# Altium project Smart_home.PrjPcb
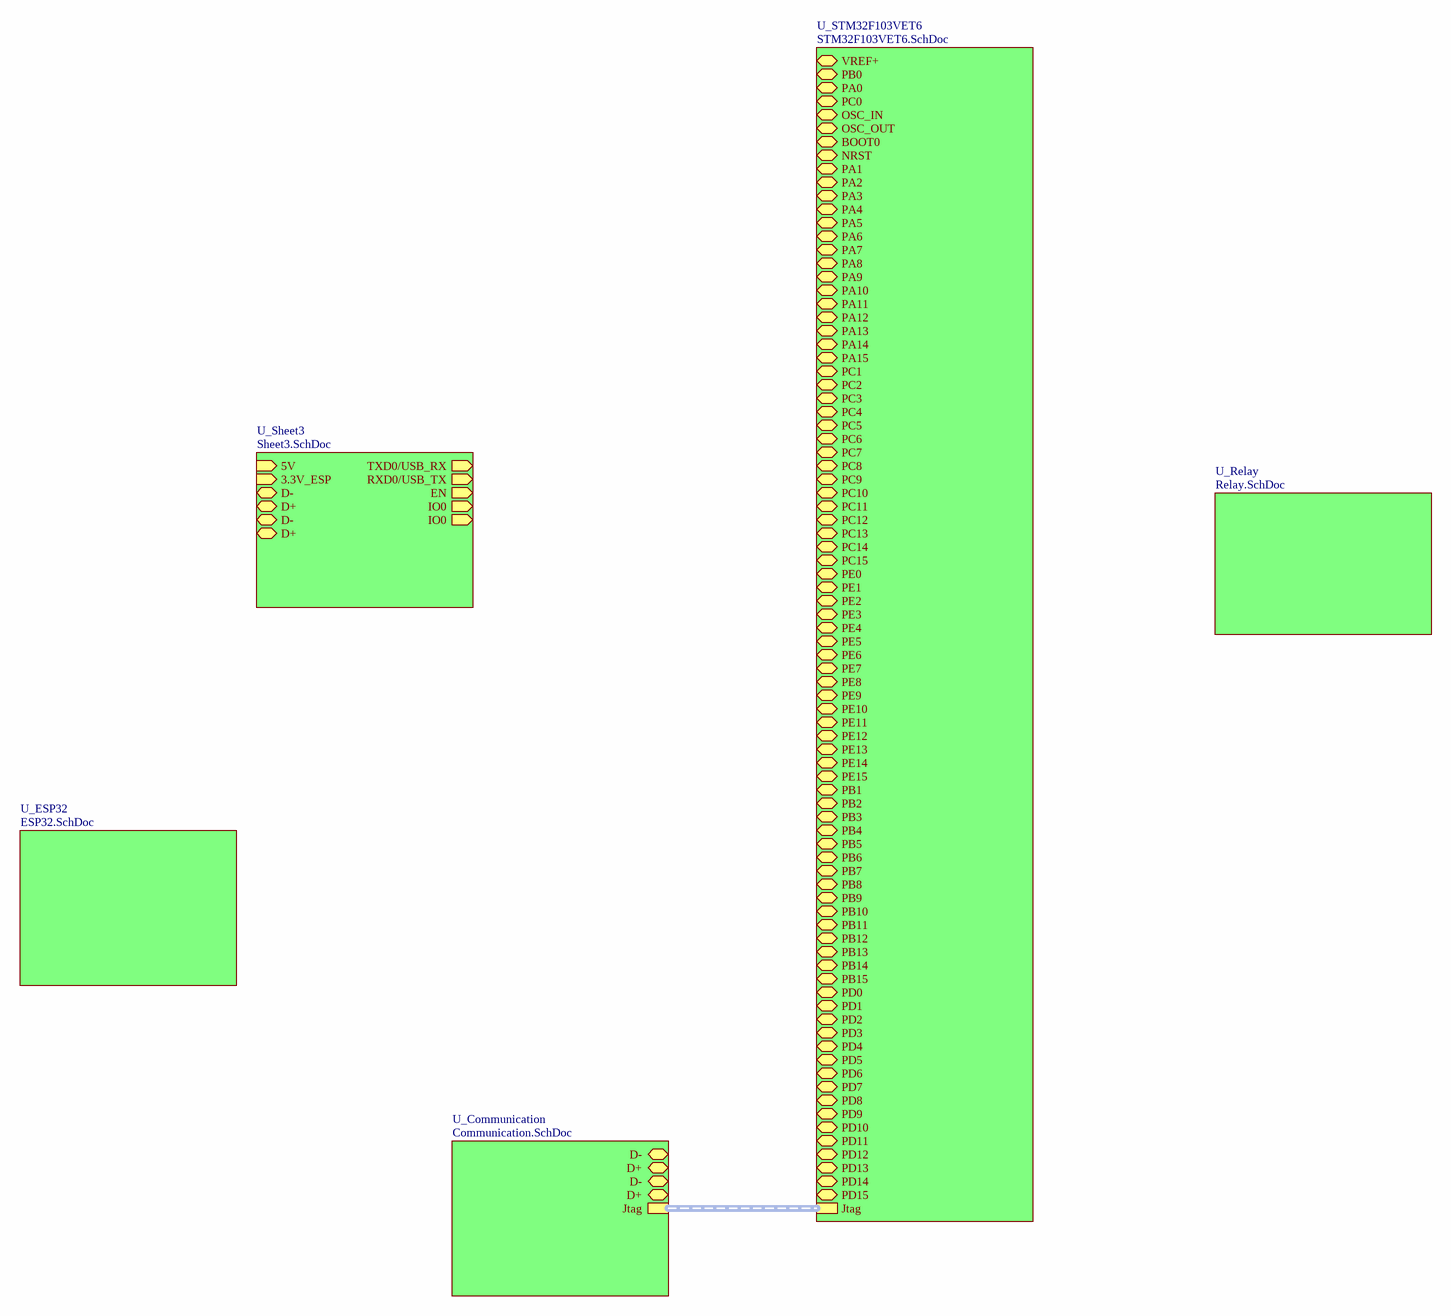
[diagram p0: Total.SchDoc]
6 sheets, 78 parts. Net scope: hierarchical (ports join the sheet entries above them; power ports are global).
Board file: PCB.PcbDoc
Sheets:
  Total.SchDoc
    U_Communication = Communication.SchDoc
    U_ESP32 = ESP32.SchDoc
    U_STM32F103VET6 = STM32F103VET6.SchDoc
    U_Sheet3 = Sheet3.SchDoc
    U_Relay = Relay.SchDoc

## Sheet Total.SchDoc
size A3; Author: Van Hieu; Organization: BACH-KHOA-DK; Gmail: maivanhieu24042003@gmail.com

### Sub-sheets
U_Communication = Communication.SchDoc: D- (bidir), D+ (bidir), D- (bidir), D+ (bidir), Jtag (harness *)
U_ESP32 = ESP32.SchDoc: no entries
U_Relay = Relay.SchDoc: no entries
U_Sheet3 = Sheet3.SchDoc: TXD0/USB_RX (out), RXD0/USB_TX (out), EN (out), IO0 (out), IO0 (out), 5V (in), 3.3V_ESP (in), D- (bidir), D+ (bidir), D- (bidir), D+ (bidir)
U_STM32F103VET6 = STM32F103VET6.SchDoc: VREF+ (bidir), PB0 (bidir), PA0 (bidir), PC0 (bidir), OSC_IN (bidir), OSC_OUT (bidir), BOOT0 (bidir), NRST (bidir), PA1 (bidir), PA2 (bidir), PA3 (bidir), PA4 (bidir), PA5 (bidir), PA6 (bidir), PA7 (bidir), PA8 (bidir), PA9 (bidir), PA10 (bidir), PA11 (bidir), PA12 (bidir), PA13 (bidir), PA14 (bidir), PA15 (bidir), PC1 (bidir), PC2 (bidir), PC3 (bidir), PC4 (bidir), PC5 (bidir), PC6 (bidir), PC7 (bidir), PC8 (bidir), PC9 (bidir), PC10 (bidir), PC11 (bidir), PC12 (bidir), PC13 (bidir), PC14 (bidir), PC15 (bidir), PE0 (bidir), PE1 (bidir), PE2 (bidir), PE3 (bidir), PE4 (bidir), PE5 (bidir), PE6 (bidir), PE7 (bidir), PE8 (bidir), PE9 (bidir), PE10 (bidir), PE11 (bidir), PE12 (bidir), PE13 (bidir), PE14 (bidir), PE15 (bidir), PB1 (bidir), PB2 (bidir), PB3 (bidir), PB4 (bidir), PB5 (bidir), PB6 (bidir), PB7 (bidir), PB8 (bidir), PB9 (bidir), PB10 (bidir), PB11 (bidir), PB12 (bidir), PB13 (bidir), PB14 (bidir), PB15 (bidir), PD0 (bidir), PD1 (bidir), PD2 (bidir), PD3 (bidir), PD4 (bidir), PD5 (bidir), PD6 (bidir), PD7 (bidir), PD8 (bidir), PD9 (bidir), PD10 (bidir), PD11 (bidir), PD12 (bidir), PD13 (bidir), PD14 (bidir), PD15 (bidir), Jtag (harness *)

### Nets
IO0: sheet U_Sheet3/IO0, sheet U_Sheet3/IO0
(unnamed): sheet U_Communication/D-, sheet U_Communication/D-
(unnamed): sheet U_Communication/D+, sheet U_Communication/D+
(unnamed): sheet U_Sheet3/D-, sheet U_Sheet3/D-
(unnamed): sheet U_Sheet3/D+, sheet U_Sheet3/D+

### Buses and harness runs
harness sheet U_Communication/Jtag = sheet U_STM32F103VET6/Jtag

### Notes on the sheet
- Van Hieu
- Date:
- Size:
- A3
- Number:
- Time:
- Sheet
- Revision:
- of
- BK-DN
- File:
- maivanhieu24042003@gmail.com

## Sheet Communication.SchDoc
size A3; Author: Van Hieu; Organization: BACH-KHOA-DK; SheetNumber: 3; SheetTotal: 6; Gmail: maivanhieu24042003@gmail.com
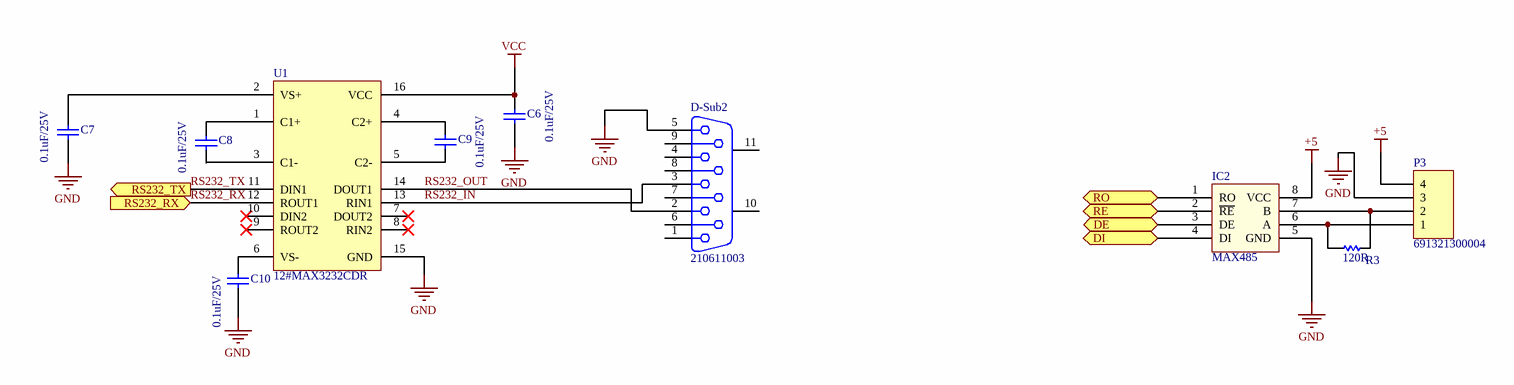
[diagram p1: Communication.SchDoc]

### Parts
(Parts that share a designator on the sheet are numbered #1, #2 ... from top to bottom, then left to right.)
C6#1  0.1uF/25V  [CAP_CERA_C2012(CC0805INCH)]
C7#1  0.1uF/25V  [CAP_CERA_C2012(CC0805INCH)]
C8#1  0.1uF/25V  [CAP_CERA_C2012(CC0805INCH)]
C9#1  0.1uF/25V  [CAP_CERA_C2012(CC0805INCH)]
C10#1  0.1uF/25V  [CAP_CERA_C2012(CC0805INCH)]
D-Sub2  210611003  [COM9SMDB]
IC2  MAX485  [DIP8/W0.3]
P3  691321300004  [TERMINAL_KF2EDGV_F_1X4_3.81]
R3  120R  [RES-SMD-0805]
U1#1  12#MAX3232CDR  [12# MAX3232CDR]

### Ports
DE (bidir), DI (bidir), RE (bidir), RO (bidir), RS232_RX (in), RS232_TX (out)

### Nets
+5: IC2.8(VCC) P3.4
GND: C6#1.1 C7#1.1 C10#1.1 D-Sub2.5 IC2.5(GND) P3.3 U1#1.15(GND)
VCC: C6#1.2 U1#1.16(VCC)
RS232_IN: D-Sub2.3 U1#1.13(RIN1)
RS232_OUT: D-Sub2.2 U1#1.14(DOUT1)
RS232_RX: U1#1.12(ROUT1) ; port RS232_RX
RS232_TX: U1#1.11(DIN1) ; port RS232_TX
NetC7#1_2: C7#1.2 U1#1.2(VS+)
NetC8#1_1: C8#1.1 U1#1.3(C1-)
NetC8#1_2: C8#1.2 U1#1.1(C1+)
NetC9#1_1: C9#1.1 U1#1.5(C2-)
NetC9#1_2: C9#1.2 U1#1.4(C2+)
NetC10#1_2: C10#1.2 U1#1.6(VS-)
NetIC2_1: IC2.1(RO) ; port RO
NetIC2_2: IC2.2(~{RE}) ; port RE
NetIC2_3: IC2.3(DE) ; port DE
NetIC2_4: IC2.4(DI) ; port DI
NetIC2_6: IC2.6(A) P3.1 R3.1
NetIC2_7: IC2.7(B) P3.2 R3.2

Not connected (* = marked no-connect by the designer): D-Sub2 1 4 6 7 8 9 10(MH1) 11(MH2); U1#1 7(DOUT2)* 8(RIN2)* 9(ROUT2)* 10(DIN2)*

### Notes on the sheet
- Van Hieu
- Date:
- Size:
- A3
- Number:
- Time:
- Sheet
- Revision:
- of
- BK-DN
- File:
- maivanhieu24042003@gmail.com

### Library data of the parts
C6#1 C7#1 C8#1 C9#1 C10#1 = 0.1uF/50V/C0603/10%: 0.1µF ±10% 25V Ceramic Capacitor X7R 0805 (2012 Metric); ComponentLink1URL: http://www.murata.com/~/media/webrenewal/support/library/catalog/products/capacitor/mlcc/c02e.ashx; ComponentLink1Description: http://www.murata.com/~/media/webrenewal/support/library/catalog/products/capacitor/mlcc/c02e.ashx; Digikey: 478-3755-1-ND
D-Sub2 = CON 9BD: D-SUB-Filter Connectors WE-DS, Solder Pin Straight; Manufacturer: Würth Elektronik eiSos GmbH; partNo: 210611003; ComponentLink1Description: Manufacturer; ComponentLink1URL: http://www.we-online.de; Created by: Christin Zierenner; Created Date: May 2012; ComponentLink2Description: Datasheet; ComponentLink2URL: http://katalog.we-online.de/kataloge/eisos/index.php?language=en&pf=Filter_gerade
IC2 = MAX485: RS232 - RS485 (Same sn75176)
P3 = TERMINAL_KF2EDGV_F_1X4_3.81: Pluggable Terminal Blocks WR-TBL Terminal block - PCB Header - THT; Manufacturer: Wurth Elektronik; Connection Method: Push-In; Current Rating: 10 A; Mounting Angle: Straight; Number of Positions: 4 Position; Voltage Rating: 300 VAC; Pitch: 3.81 mm; Supplier 1: Mouser; Manufacturer Part Number: 691321300004; RoHS: RoHS Compliant; Category: Pluggable Terminal Blocks; Stock 1: 0; Pricing 1: 1=0.710, 10=0.638, 50=0.590 (USD); Color: Green; Contact Plating: Tin; Height: 9.2 mm; Housing Material: Polyamide (PA); Length: 16.43 mm; Packaging: Bulk; Product: Headers; Series: WR-TBL; Termination Style: Through Hole; Width: 7.2 mm; Brand: Wurth Elektronik; Contact Material: Brass; Flammability Rating: UL 94 V-0; Mounting Style: PCB Mount; Product Type: Pluggable Terminal Blocks; Standard Pack Qty: 500; Subcategory: Terminal Blocks; RoHS - Mouser: Y; Minimum Order Quantity: 1; Reeling: False; ComponentLink1URL: https://www.mouser.com/datasheet/2/445/691321300004-1719625.pdf; ComponentLink1Description: https://www.mouser.com/datasheet/2/445/691321300004-1719625.pdf; Supplier Part Number 1: 710-691321300004
R3 = Res-SMD_2_2: Resistor; Manufacturer: Generic Components; Class: Passive; Published: 08/06/2000; Publisher: Altium Hobart Technology Centre
U1#1 = 12#MAX3232CDR: IC DRVR/RCVR MULTCH RS232 16SOIC; Manufacturer: Texas Instruments; Number of Receivers: 2; Data Rate: 250Kbps; Operating Supply Voltage: 5V; Max Supply Voltage: 5.5V; Min Supply Voltage: 3V; Nominal Supply Current: 1mA; Logic Function: Receiver,Transceiver; Number of Transceivers: 1; Output Voltage: 5.4V; Simplex/Duplex: Full Duplex; ESD Protection: Yes; Supplier 1: Digi-Key; Manufacturer Part Number: MAX3232CDR; Stock 1: 41536; Pricing 1: 1=1.89, 10=1.695, 100=1.3624, 500=1.1194, 1000=0.9275 (USD); Mount: Surface Mount; Case/Package: D; Number of Pins: 16; Weight: 0.004998oz; Contact Plating: Gold; Min Operating Temperature: -40°C; Max Operating Temperature: 85°C; Number of Transmitters: 2; Packaging: Tape and Reel; Package Quantity: 1; Number of Drivers: 2; Operating Supply Current: 1mA; Max Supply Current: 1mA; Length: 9.9mm; Height: 1.58mm; Width: 3.91mm; Radiation Hardening: No; REACH SVHC: No SVHC; Lead Free: Lead Free; Supplier Part Number 1: 296-13094-1-ND

## Sheet ESP32.SchDoc
size A3; Author: Van Hieu; Organization: BACH-KHOA-DK; SheetNumber: 6; SheetTotal: 6; Gmail: maivanhieu24042003@gmail.com
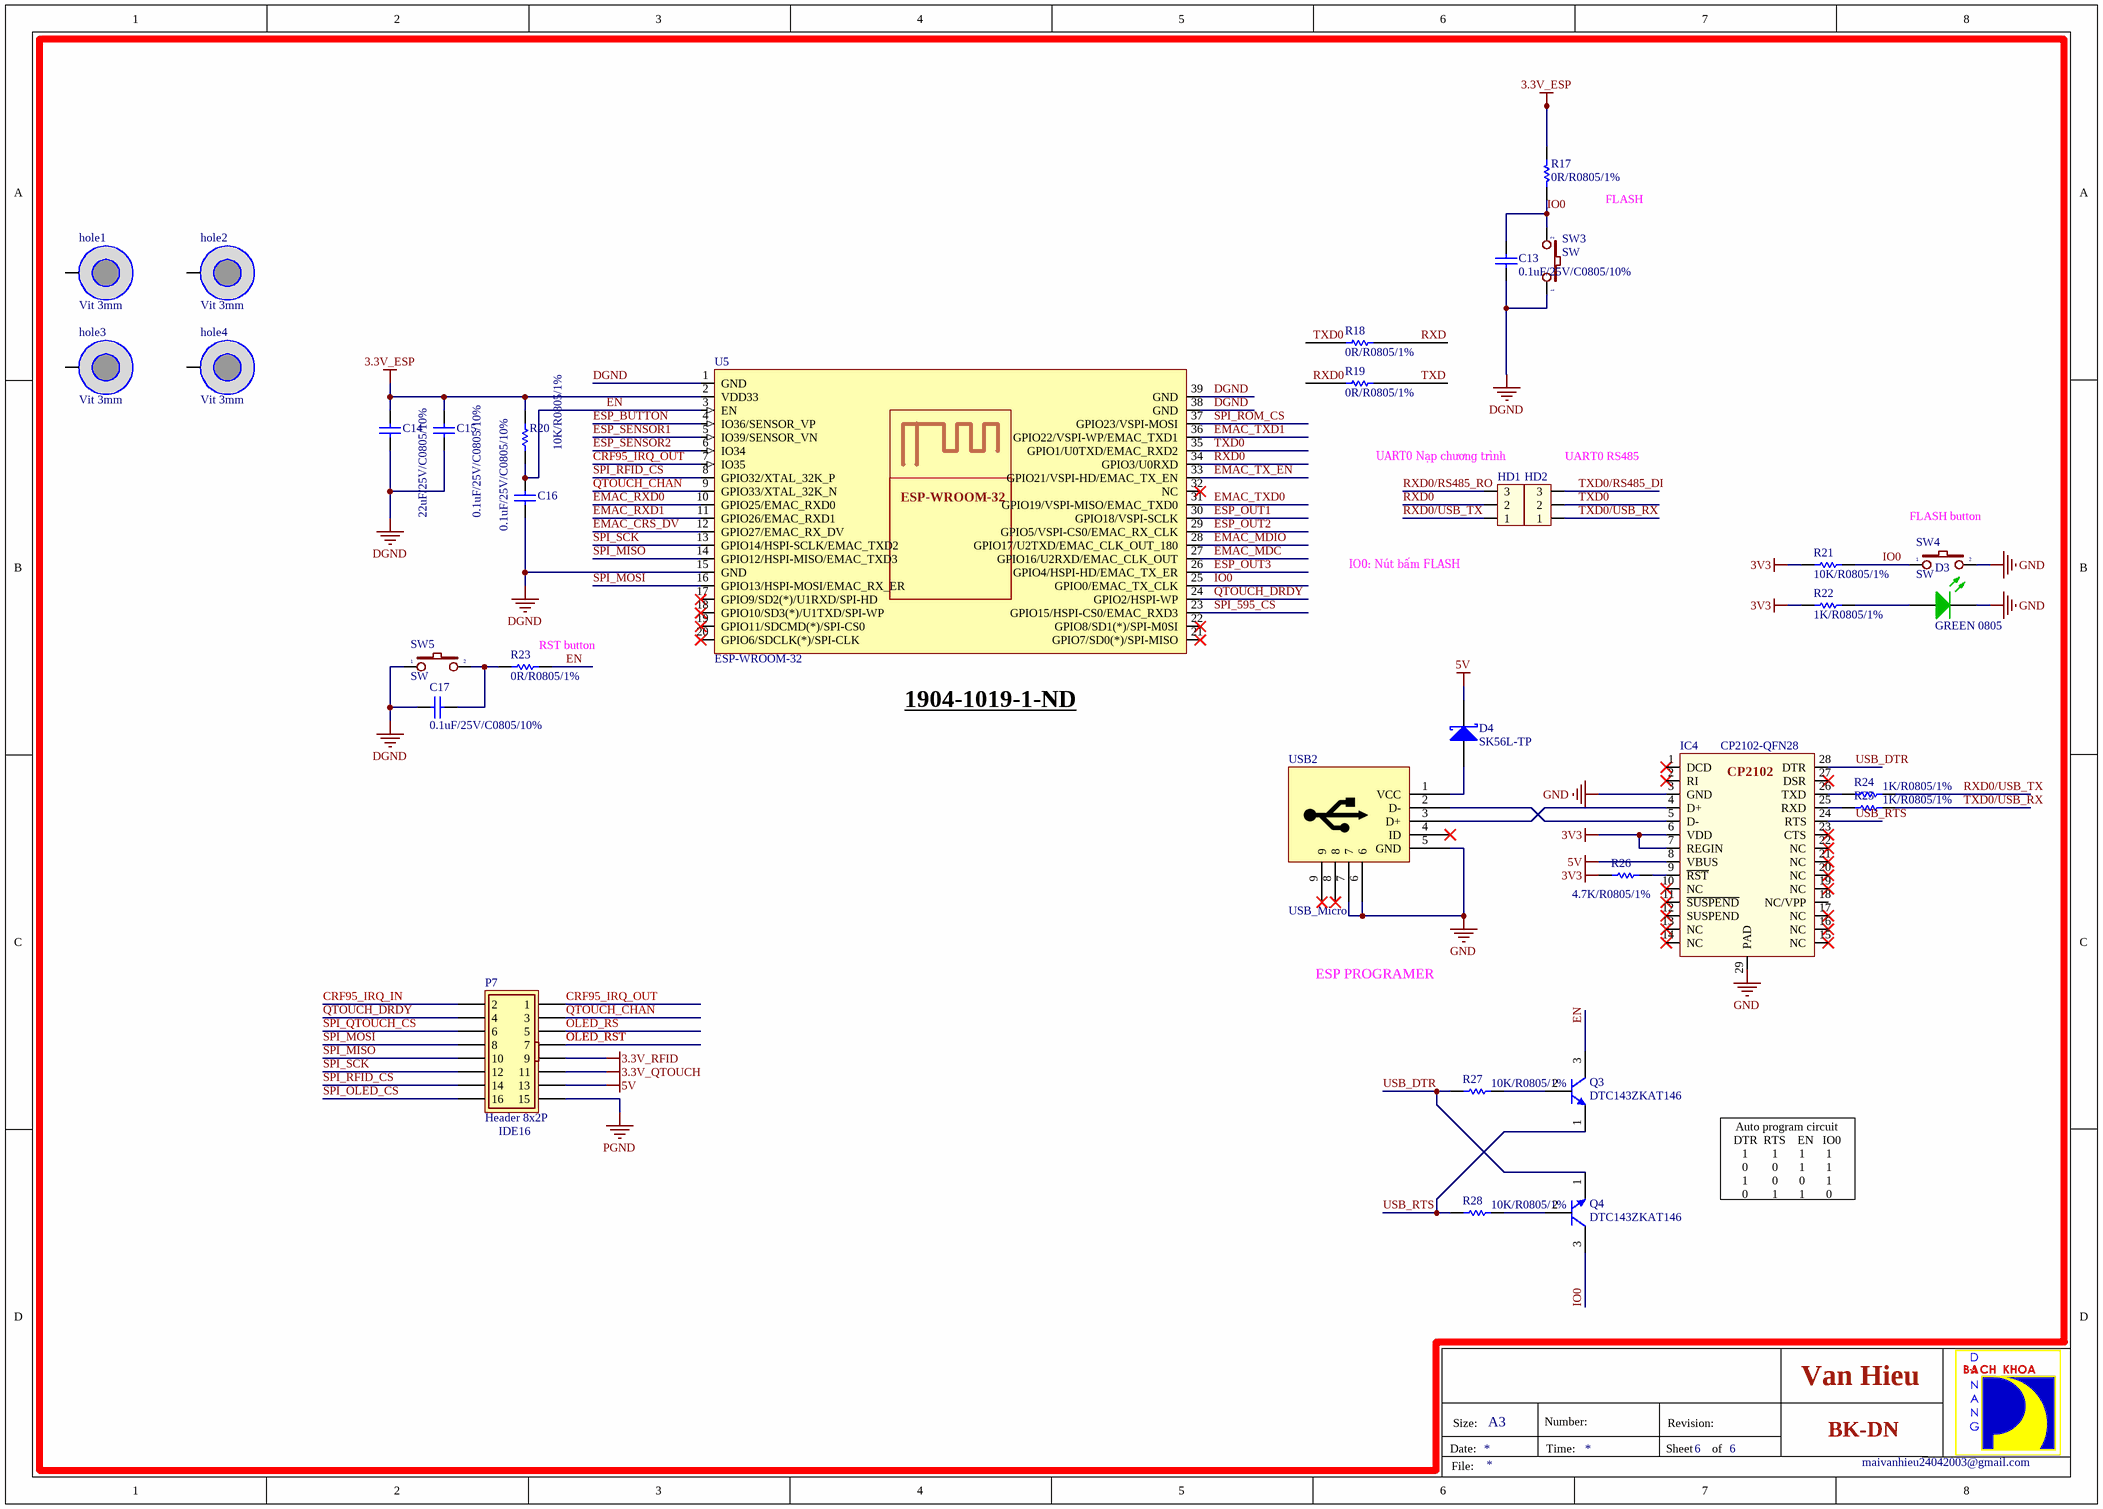
[diagram p2: ESP32.SchDoc]

### Parts
C13  0.1uF/25V/C0805/10%  [CAP_CERA_C2012(CC0805INCH)]
C14  22uF/25V/C0805/10%  [CAP_CERA_C2012(CC0805INCH)]
C15  0.1uF/25V/C0805/10%  [CAP_CERA_C2012(CC0805INCH)]
C16  0.1uF/25V/C0805/10%  [CAP_CERA_C2012(CC0805INCH)]
C17  0.1uF/25V/C0805/10%  [CAP_CERA_C2012(CC0805INCH)]
D3  GREEN 0805  [Led 0805G]
D4  SK56L-TP  [30# SK56L-TPMSCT-ND]
HD1  Header 3  [Header_3]  (value not drawn)
HD2  Header 3  [Header_3]  (value not drawn)
hole1  Vit 3mm  [Screw 3.0]
hole2  Vit 3mm  [Screw 3.0]
hole3  Vit 3mm  [Screw 3.0]
hole4  Vit 3mm  [Screw 3.0]
IC4  CP2102-QFN28  [CP2102]
P7  Header 8x2P  [Header IDE16 8x2 -]
Q3  DTC143ZKAT146  [6# DTC143ZKAT146-E]
Q4  DTC143ZKAT146  [6# DTC143ZKAT146-E]
R17  0R/R0805/1%  [Res 0805 SMD]
R18  0R/R0805/1%  [Res 0805 SMD]
R19  0R/R0805/1%  [Res 0805 SMD]
R20  10K/R0805/1%  [Res 0805 SMD]
R21  10K/R0805/1%  [Res 0805 SMD]
R22  1K/R0805/1%  [Res 0805 SMD]
R23  0R/R0805/1%  [Res 0805 SMD]
R24  1K/R0805/1%  [Res 0805 SMD]
R25  1K/R0805/1%  [Res 0805 SMD]
R26  4.7K/R0805/1%  [Res 0805 SMD]
R27  10K/R0805/1%  [Res 0805 SMD]
R28  10K/R0805/1%  [Res 0805 SMD]
SW3  SW  [BUTTON 2PIN TRON]
SW4  SW  [BUTTON 2PIN TRON]
SW5  SW  [BUTTON 2PIN TRON]
U5  ESP-WROOM-32  [ESP32 WROOM]
USB2  USB_Micro  [USBMNIB]

### Nets
3.3V_ESP: C14.2 C15.2 R17.2 R20.1 U5.2(VDD33)
3.3V_QTOUCH: P7.11
3.3V_RFID: P7.9
3V3: IC4.6(VDD) IC4.7(REGIN) R21.1 R22.1 R26.1
5V: D4.2(K) IC4.8(VBUS) P7.13
DGND: C13.2 C14.1 C15.1 C16.1 C17.2 SW3.1 SW5.1 U5.1(GND) U5.15(GND) U5.38(GND) U5.39(GND)
GND: D3.2(K) IC4.3(GND) IC4.29(PAD) SW4.2 USB2.5(GND) USB2.6 USB2.7
PGND: P7.15
CRF95_IRQ_IN: P7.2
CRF95_IRQ_OUT: P7.1 U5.7(IO35)
EMAC_CRS_DV: U5.12(GPIO27/EMAC_RX_DV)
EMAC_MDC: U5.27(GPIO16/U2RXD/EMAC_CLK_OUT)
EMAC_MDIO: U5.28(GPIO17/U2TXD/EMAC_CLK_OUT_180)
EMAC_RXD0: U5.10(GPIO25/EMAC_RXD0)
EMAC_RXD1: U5.11(GPIO26/EMAC_RXD1)
EMAC_TX_EN: U5.33(GPIO21/VSPI-HD/EMAC_TX_EN)
EMAC_TXD0: U5.31(GPIO19/VSPI-MISO/EMAC_TXD0)
EMAC_TXD1: U5.36(GPIO22/VSPI-WP/EMAC_TXD1)
EN: C16.2 Q3.3(C) R20.2 R23.2 U5.3(EN)
ESP_BUTTON: U5.4(IO36/SENSOR_VP)
ESP_OUT1: U5.30(GPIO18/VSPI-SCLK)
ESP_OUT2: U5.29(GPIO5/VSPI-CS0/EMAC_RX_CLK)
ESP_OUT3: U5.26(GPIO4/HSPI-HD/EMAC_TX_ER)
ESP_SENSOR1: U5.5(IO39/SENSOR_VN)
ESP_SENSOR2: U5.6(IO34)
IO0: C13.1 Q4.3(C) R17.1 R21.2 SW3.2 SW4.1 U5.25(GPIO0/EMAC_TX_CLK)
OLED_RS: P7.5
OLED_RST: P7.7
QTOUCH_CHAN: P7.3 U5.9(GPIO33/XTAL_32K_N)
QTOUCH_DRDY: P7.4 U5.24(GPIO2/HSPI-WP)
RXD: R18.1
RXD0: HD1.2 R19.2 U5.34(GPIO3/U0RXD)
RXD0/RS485_RO: HD1.3
RXD0/USB_TX: HD1.1 R24.1
SPI_595_CS: U5.23(GPIO15/HSPI-CS0/EMAC_RXD3)
SPI_MISO: P7.10 U5.14(GPIO12/HSPI-MISO/EMAC_TXD3)
SPI_MOSI: P7.8 U5.16(GPIO13/HSPI-MOSI/EMAC_RX_ER)
SPI_OLED_CS: P7.16
SPI_QTOUCH_CS: P7.6
SPI_RFID_CS: P7.14 U5.8(GPIO32/XTAL_32K_P)
SPI_ROM_CS: U5.37(GPIO23/VSPI-MOSI)
SPI_SCK: P7.12 U5.13(GPIO14/HSPI-SCLK/EMAC_TXD2)
TXD: R19.1
TXD0: HD2.2 R18.2 U5.35(GPIO1/U0TXD/EMAC_RXD2)
TXD0/RS485_DI: HD2.3
TXD0/USB_RX: HD2.1 R25.1
USB_DTR: IC4.28(DTR) Q4.1(E) R27.2
USB_RTS: IC4.24(RTS) Q3.1(E) R28.2
NetC17_1: C17.1 R23.1 SW5.2
NetD3_1: D3.1(A) R22.2
NetD4_1: D4.1(A) USB2.1(VCC)
NetIC4_4: IC4.4(D+) USB2.3(D+)
NetIC4_5: IC4.5(D-) USB2.2(D-)
NetIC4_9: IC4.9(~{RST}) R26.2
NetIC4_25: IC4.25(RXD) R25.2
NetIC4_26: IC4.26(TXD) R24.2
NetQ3_2: Q3.2(B) R27.1
NetQ4_2: Q4.2(B) R28.1

Not connected (* = marked no-connect by the designer): hole1 1(hole); hole2 1(hole); hole3 1(hole); hole4 1(hole); IC4 1(DCD)* 2(RI)* 10(NC)* 11(~{SUSPEND})* 12(SUSPEND)* 13(NC)* 14(NC)* 15(NC)* 16(NC)* 17(NC)* 18(NC/VPP) 19(NC)* 20(NC)* 21(NC)* 22(NC)* 23(CTS)* 27(DSR)*; U5 17(GPIO9/SD2(*)/U1RXD/SPI-HD)* 18(GPIO10/SD3(*)/U1TXD/SPI-WP)* 19(GPIO11/SDCMD(*)/SPI-CS0)* 20(GPIO6/SDCLK(*)/SPI-CLK)* 21(GPIO7/SD0(*)/SPI-MISO)* 22(GPIO8/SD1(*)/SPI-M0SI)* 32(NC)*; USB2 4(ID)* 8* 9*

### Notes on the sheet
- FLASH
- (near HD1) UART0 Nạp chương trình
- (near HD2) UART0 RS485
- (near SW4) FLASH button
- IO0: Nút bấm FLASH
- (near R23) RST button
- (near U5) 1904-1019-1-ND
- ESP PROGRAMER
- (near P7) IDE16
- Auto program circuit
  DTR  RTS    EN   IO0
  1        1       1       1
  0        0       1       1
  1        0       0       1
  0        1       1       0
- Van Hieu
- Date:
- Size:
- A3
- Number:
- Time:
- Sheet
- Revision:
- of
- BK-DN
- File:
- maivanhieu24042003@gmail.com

### Library data of the parts
C13 C15-C17 = 0.1uF/50V/C0603/10%: as C6#1 on sheet Communication; ComponentLink1URL: http://www.murata.com/~/media/webrenewal/support/library/catalog/products/capacitor/mlcc/c02e.ashx; ComponentLink1Description: http://www.murata.com/~/media/webrenewal/support/library/catalog/products/capacitor/mlcc/c02e.ashx; Digikey: 478-3755-1-ND
C14 = 0.1uF/50V/C0603/10%: 22µF ±20% 25V Ceramic Capacitor X5R 0805 (2012 Metric); Manufacturer: Tariff Applied; ComponentLink1URL: http://www.murata.com/~/media/webrenewal/support/library/catalog/products/capacitor/mlcc/c02e.ashx; ComponentLink1Description: http://www.murata.com/~/media/webrenewal/support/library/catalog/products/capacitor/mlcc/c02e.ashx; Digikey: 1276-2908-1-ND
D3 = LED GREEN 0603: Green 571nm LED Indication - Discrete 2V 0805 (2012 Metric); ComponentLink1URL: http://optoelectronics.liteon.com/upload/download/DS22-2000-074/S_110_LTST-C190KGKT.pdf; ComponentLink1Description: http://optoelectronics.liteon.com/upload/download/DS22-2000-074/S_110_LTST-C190KGKT.pdf; Digikey: 160-1426-1-ND
D4 = 30# SK56L-TP: DIODE SCHOTTKY 60V 5A DO214AB; ComponentLink1URL: http://www.mccsemi.com/up_pdf/SK52L-SK510L(DO-214AB).PDF; ComponentLink1Description: http://www.mccsemi.com/up_pdf/SK52L-SK510L(DO-214AB).PDF; Digikey: SK56L-TPMSCT-ND
HD1 HD2 = Header3: Value: Header 3
IC4 = CP2102
P7 = Header IDE 8x2P: IDE16 Đực Thẳng 2.54MM; BuyVN: https://banlinhkien.vn/goods-764-ide16-duc-thang-2-54mm.html
Q3 Q4 = 6#DTC143ZKAT146: Pre-Biased Bipolar Transistor (BJT) NPN - Pre-Biased 50V 100mA 250MHz 200mW Surface Mount SMT3; Digikey: DTC143ZKAT146CT-ND
R17 R23 = 200K/R0603/1%: 0 Ohms Jumper 0.125W, 1/8W Chip Resistor 0805 (2012 Metric) Automotive AEC-Q200 Thick Film; Part Status: Active; Height - Seated (Max): 0.022" (0.55mm); Failure Rate: -; ComponentLink1URL: http://www.yageo.com/documents/recent/PYu-RC_Group_51_RoHS_L_7.pdf; ComponentLink1Description: http://www.yageo.com/documents/recent/PYu-RC_Group_51_RoHS_L_7.pdf; Digikey: 541-0.0ACT-ND
R18 R19 = 10K/R0603/1%: 0 Ohms Jumper 0.125W, 1/8W Chip Resistor 0805 (2012 Metric) Automotive AEC-Q200 Thick Film; Resistance (Ohms): 10k; Height: 0.022" (0.55mm); Number of Terminations: 2; ComponentLink1URL: http://www.yageo.com/NewPortal/yageodocoutput?fileName=/pdf/R-Chip/PYu-RC_Group_51_RoHS_L_3.pdf; ComponentLink1Description: http://www.yageo.com/NewPortal/yageodocoutput?fileName=/pdf/R-Chip/PYu-RC_Group_51_RoHS_L_3.pdf; Digikey: 541-0.0ACT-ND
R20 R21 = 200K/R0603/1%: 10 kOhms ±1% 0.125W, 1/8W Chip Resistor 0805 (2012 Metric) Thick Film; Power (Watts): 0.1W, 1/10W; RoHS: RoHS Compliant; Category: Resistors; Part Status: Active; Features: Moisture Resistant; Operating Temperature: -55°C ~ 155°C; Package / Case: 0603 (1608 Metric); Supplier Device Package: 0603; Size / Dimension: 0.063" L x 0.031" W (1.60mm x 0.80mm); Height - Seated (Max): 0.022" (0.55mm); Failure Rate: -; ComponentLink1URL: http://www.yageo.com/documents/recent/PYu-RC_Group_51_RoHS_L_7.pdf; ComponentLink1Description: http://www.yageo.com/documents/recent/PYu-RC_Group_51_RoHS_L_7.pdf; Digikey: A126332CT-ND
R22 = 200K/R0603/1%: 1 kOhms ±1% 0.125W, 1/8W Chip Resistor 0805 (2012 Metric) Automotive AEC-Q200 Thick Film; Power (Watts): 0.1W, 1/10W; RoHS: RoHS Compliant; Category: Resistors; Part Status: Active; Features: Moisture Resistant; Operating Temperature: -55°C ~ 155°C; Package / Case: 0603 (1608 Metric); Supplier Device Package: 0603; Size / Dimension: 0.063" L x 0.031" W (1.60mm x 0.80mm); Height - Seated (Max): 0.022" (0.55mm); Failure Rate: -; ComponentLink1URL: http://www.yageo.com/documents/recent/PYu-RC_Group_51_RoHS_L_7.pdf; ComponentLink1Description: http://www.yageo.com/documents/recent/PYu-RC_Group_51_RoHS_L_7.pdf; Digikey: 541-1.00KCCT-ND
R24 R25 = 34.8K/R0805/1%: 1 kOhms ±1% 0.125W, 1/8W Chip Resistor 0805 (2012 Metric) Automotive AEC-Q200 Thick Film; Power Rating: 100mW; Resistance: 34.8kR; Voltage Rating: 50V; Case/Package: 0603; Case Code (Imperial): 0603; Case Code (Metric): 1608; Min Operating Temperature: -55°C; Max Operating Temperature: 155°C; Termination: SMD/SMT; Military Standard: Not; Voltage Rating (DC): 50V; Length: 1.6mm; Height: 0.45mm; Width: 0.8mm; Depth: 0.8mm; Lead Free: Lead Free; Digikey: 541-1.00KCCT-ND
R26 = 34.8K/R0805/1%: 4.7 kOhms ±1% 0.125W, 1/8W Chip Resistor 0805 (2012 Metric) Thick Film; Digikey: 541-4131-1-ND
R27 R28 = 34.8K/R0805/1%: 10 kOhms ±1% 0.125W, 1/8W Chip Resistor 0805 (2012 Metric) Thick Film; Power Rating: 100mW; Resistance: 34.8kR; Voltage Rating: 50V; Case/Package: 0603; Case Code (Imperial): 0603; Case Code (Metric): 1608; Min Operating Temperature: -55°C; Max Operating Temperature: 155°C; Termination: SMD/SMT; Military Standard: Not; Voltage Rating (DC): 50V; Length: 1.6mm; Height: 0.45mm; Width: 0.8mm; Depth: 0.8mm; Lead Free: Lead Free; Digikey: A126332CT-ND
SW3-SW5 = SW2: Switch button 2 pin; Value: SW chip 2 pin
USB2 = USB_MINI

## Sheet STM32F103VET6.SchDoc
size A3; Author: Van Hieu; Organization: BACH-KHOA-DK; SheetNumber: 4; SheetTotal: 6; Gmail: maivanhieu24042003@gmail.com
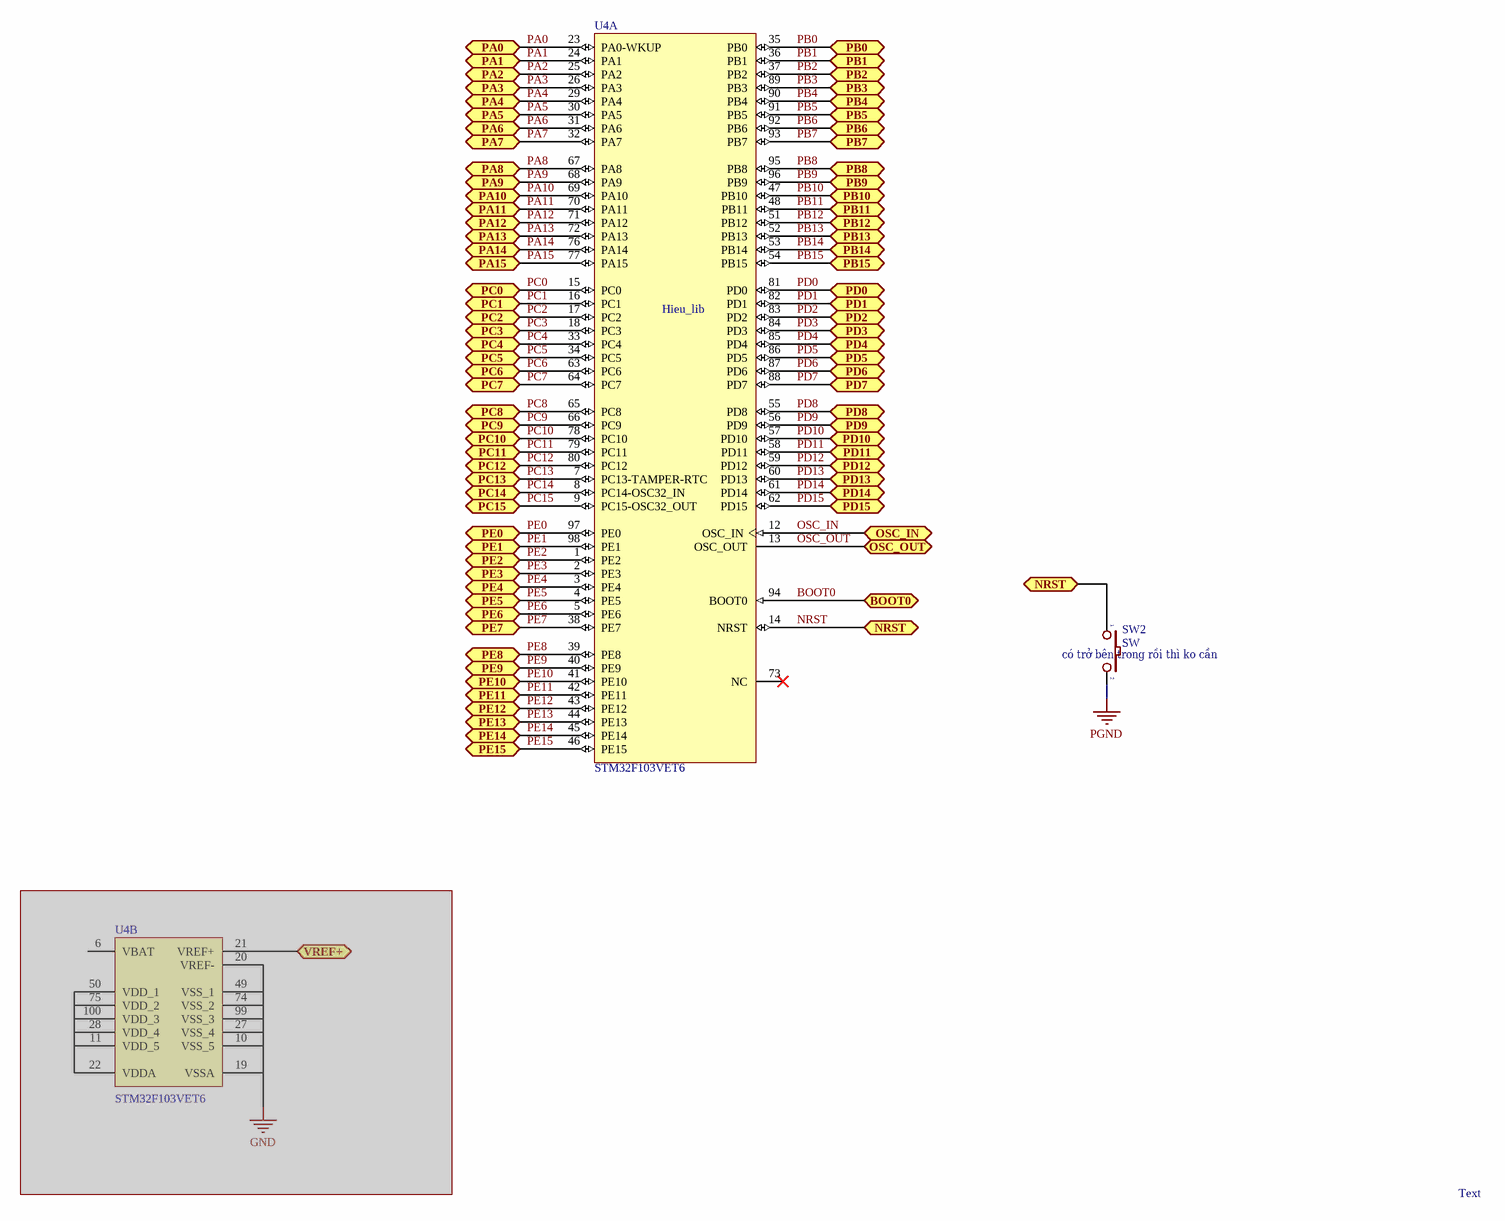
[diagram p3: STM32F103VET6.SchDoc]

### Parts
SW2  SW  [BUTTON 2PIN TRON]
U4  STM32F103VET6  [STM-LQFP100_N]  (parts A,B of 2)

### Ports
BOOT0 (bidir), NRST (bidir), OSC_IN (bidir), OSC_OUT (bidir), PA0 (bidir), PA1 (bidir), PA2 (bidir), PA3 (bidir), PA4 (bidir), PA5 (bidir), PA6 (bidir), PA7 (bidir), PA8 (bidir), PA9 (bidir), PA10 (bidir), PA11 (bidir), PA12 (bidir), PA13 (bidir), PA14 (bidir), PA15 (bidir), PB0 (bidir), PB1 (bidir), PB2 (bidir), PB3 (bidir), PB4 (bidir), PB5 (bidir), PB6 (bidir), PB7 (bidir), PB8 (bidir), PB9 (bidir), PB10 (bidir), PB11 (bidir), PB12 (bidir), PB13 (bidir), PB14 (bidir), PB15 (bidir), PC0 (bidir), PC1 (bidir), PC2 (bidir), PC3 (bidir), PC4 (bidir), PC5 (bidir), PC6 (bidir), PC7 (bidir), PC8 (bidir), PC9 (bidir), PC10 (bidir), PC11 (bidir), PC12 (bidir), PC13 (bidir), PC14 (bidir), PC15 (bidir), PD0 (bidir), PD1 (bidir), PD2 (bidir), PD3 (bidir), PD4 (bidir), PD5 (bidir), PD6 (bidir), PD7 (bidir), PD8 (bidir), PD9 (bidir), PD10 (bidir), PD11 (bidir), PD12 (bidir), PD13 (bidir), PD14 (bidir), PD15 (bidir), PE0 (bidir), PE1 (bidir), PE2 (bidir), PE3 (bidir), PE4 (bidir), PE5 (bidir), PE6 (bidir), PE7 (bidir), PE8 (bidir), PE9 (bidir), PE10 (bidir), PE11 (bidir), PE12 (bidir), PE13 (bidir), PE14 (bidir), PE15 (bidir), VREF+ (bidir)

### Nets
PGND: SW2.2
BOOT0: U4.94(BOOT0) ; port BOOT0
NRST: SW2.1 U4.14(NRST) ; port NRST
OSC_IN: U4.12(OSC_IN) ; port OSC_IN
OSC_OUT: U4.13(OSC_OUT) ; port OSC_OUT
PA0: U4.23(PA0-WKUP) ; port PA0
PA1: U4.24(PA1) ; port PA1
PA2: U4.25(PA2) ; port PA2
PA3: U4.26(PA3) ; port PA3
PA4: U4.29(PA4) ; port PA4
PA5: U4.30(PA5) ; port PA5
PA6: U4.31(PA6) ; port PA6
PA7: U4.32(PA7) ; port PA7
PA8: U4.67(PA8) ; port PA8
PA9: U4.68(PA9) ; port PA9
PA10: U4.69(PA10) ; port PA10
PA11: U4.70(PA11) ; port PA11
PA12: U4.71(PA12) ; port PA12
PA13: U4.72(PA13) ; port PA13
PA14: U4.76(PA14) ; port PA14
PA15: U4.77(PA15) ; port PA15
PB0: U4.35(PB0) ; port PB0
PB1: U4.36(PB1) ; port PB1
PB2: U4.37(PB2) ; port PB2
PB3: U4.89(PB3) ; port PB3
PB4: U4.90(PB4) ; port PB4
PB5: U4.91(PB5) ; port PB5
PB6: U4.92(PB6) ; port PB6
PB7: U4.93(PB7) ; port PB7
PB8: U4.95(PB8) ; port PB8
PB9: U4.96(PB9) ; port PB9
PB10: U4.47(PB10) ; port PB10
PB11: U4.48(PB11) ; port PB11
PB12: U4.51(PB12) ; port PB12
PB13: U4.52(PB13) ; port PB13
PB14: U4.53(PB14) ; port PB14
PB15: U4.54(PB15) ; port PB15
PC0: U4.15(PC0) ; port PC0
PC1: U4.16(PC1) ; port PC1
PC2: U4.17(PC2) ; port PC2
PC3: U4.18(PC3) ; port PC3
PC4: U4.33(PC4) ; port PC4
PC5: U4.34(PC5) ; port PC5
PC6: U4.63(PC6) ; port PC6
PC7: U4.64(PC7) ; port PC7
PC8: U4.65(PC8) ; port PC8
PC9: U4.66(PC9) ; port PC9
PC10: U4.78(PC10) ; port PC10
PC11: U4.79(PC11) ; port PC11
PC12: U4.80(PC12) ; port PC12
PC13: U4.7(PC13-TAMPER-RTC) ; port PC13
PC14: U4.8(PC14-OSC32_IN) ; port PC14
PC15: U4.9(PC15-OSC32_OUT) ; port PC15
PD0: U4.81(PD0) ; port PD0
PD1: U4.82(PD1) ; port PD1
PD2: U4.83(PD2) ; port PD2
PD3: U4.84(PD3) ; port PD3
PD4: U4.85(PD4) ; port PD4
PD5: U4.86(PD5) ; port PD5
PD6: U4.87(PD6) ; port PD6
PD7: U4.88(PD7) ; port PD7
PD8: U4.55(PD8) ; port PD8
PD9: U4.56(PD9) ; port PD9
PD10: U4.57(PD10) ; port PD10
PD11: U4.58(PD11) ; port PD11
PD12: U4.59(PD12) ; port PD12
PD13: U4.60(PD13) ; port PD13
PD14: U4.61(PD14) ; port PD14
PD15: U4.62(PD15) ; port PD15
PE0: U4.97(PE0) ; port PE0
PE1: U4.98(PE1) ; port PE1
PE2: U4.1(PE2) ; port PE2
PE3: U4.2(PE3) ; port PE3
PE4: U4.3(PE4) ; port PE4
PE5: U4.4(PE5) ; port PE5
PE6: U4.5(PE6) ; port PE6
PE7: U4.38(PE7) ; port PE7
PE8: U4.39(PE8) ; port PE8
PE9: U4.40(PE9) ; port PE9
PE10: U4.41(PE10) ; port PE10
PE11: U4.42(PE11) ; port PE11
PE12: U4.43(PE12) ; port PE12
PE13: U4.44(PE13) ; port PE13
PE14: U4.45(PE14) ; port PE14
PE15: U4.46(PE15) ; port PE15

Not connected (* = marked no-connect by the designer): U4 73(NC)*

### Notes on the sheet
- (near SW2) có trở bên trong rồi thì ko cần
- Text
- Van Hieu
- Date:
- Size:
- A3
- Number:
- Time:
- Sheet
- Revision:
- of
- BK-DN
- File:
- maivanhieu24042003@gmail.com
- (in symbol STM32F103VET6, part A) Hieu_lib

### Library data of the parts
SW2 = SW2: as SW3 on sheet ESP32
U4 = STM32F103VET6: ARM Cortex-M3 32-bit MCU, 512 KB Flash, 64 KB Internal RAM, 80 I/Os, 100-pin LQFP, -40 to 85 degC, Tray; A/D Converter: 3x12-bit (16 Channel); D/A Converter: 2x12-bit (2 Channel); FLASH Size (Prog) (kB): 512; I/Os (High Current): 80; Internal RAM Size (kB): 64; Operating Frequency(F) (Processor speed) (MHz): 72; Supply Voltage(Vcc) min (V): 2; DatasheetVersion: Rev. 8; PackageVersion: Rev. 1, 06/2013; PackageReference: LQFP100; PackageDescription: 100-Pin Low Profile Quad Flat Package, 14 x 14 mm Body, 0.5 mm Pitch; Supplier 1: Digi-Key; Supplier Part Number 1: 497-6443-ND; Supplier 2: Farnell; Supplier Part Number 2: 1624141; Supplier 3: Newark; Supplier Part Number 3: 01P4104; Supplier 4: Newark; Supplier Part Number 4: 57P1260; Supplier 5: Mouser; Supplier Part Number 5: 511-STM32F103VET6; Core: ARM Cortex-M3; Packing: Tray; Mounting Technology: Surface Mount; PartNumber: STM32F103VET6; ComponentLink1Description: Manufacturer URL; ComponentLink1URL: http://www.st.com/web/en/home.html; ComponentLink2Description: Datasheet; ComponentLink2URL: http://www.st.com/st-web-ui/static/active/en/resource/technical/document/datasheet/CD00191185.pdf; ComponentLink3Description: Package Specification; ComponentLink3URL: http://www.st.com/st-web-ui/static/active/en/resource/technical/document/data_brief/DM00071938.pdf

## Sheet Sheet3.SchDoc
size A3; Author: Van Hieu; Organization: BACH-KHOA-DK; SheetNumber: 2; SheetTotal: 6; Gmail: maivanhieu24042003@gmail.com
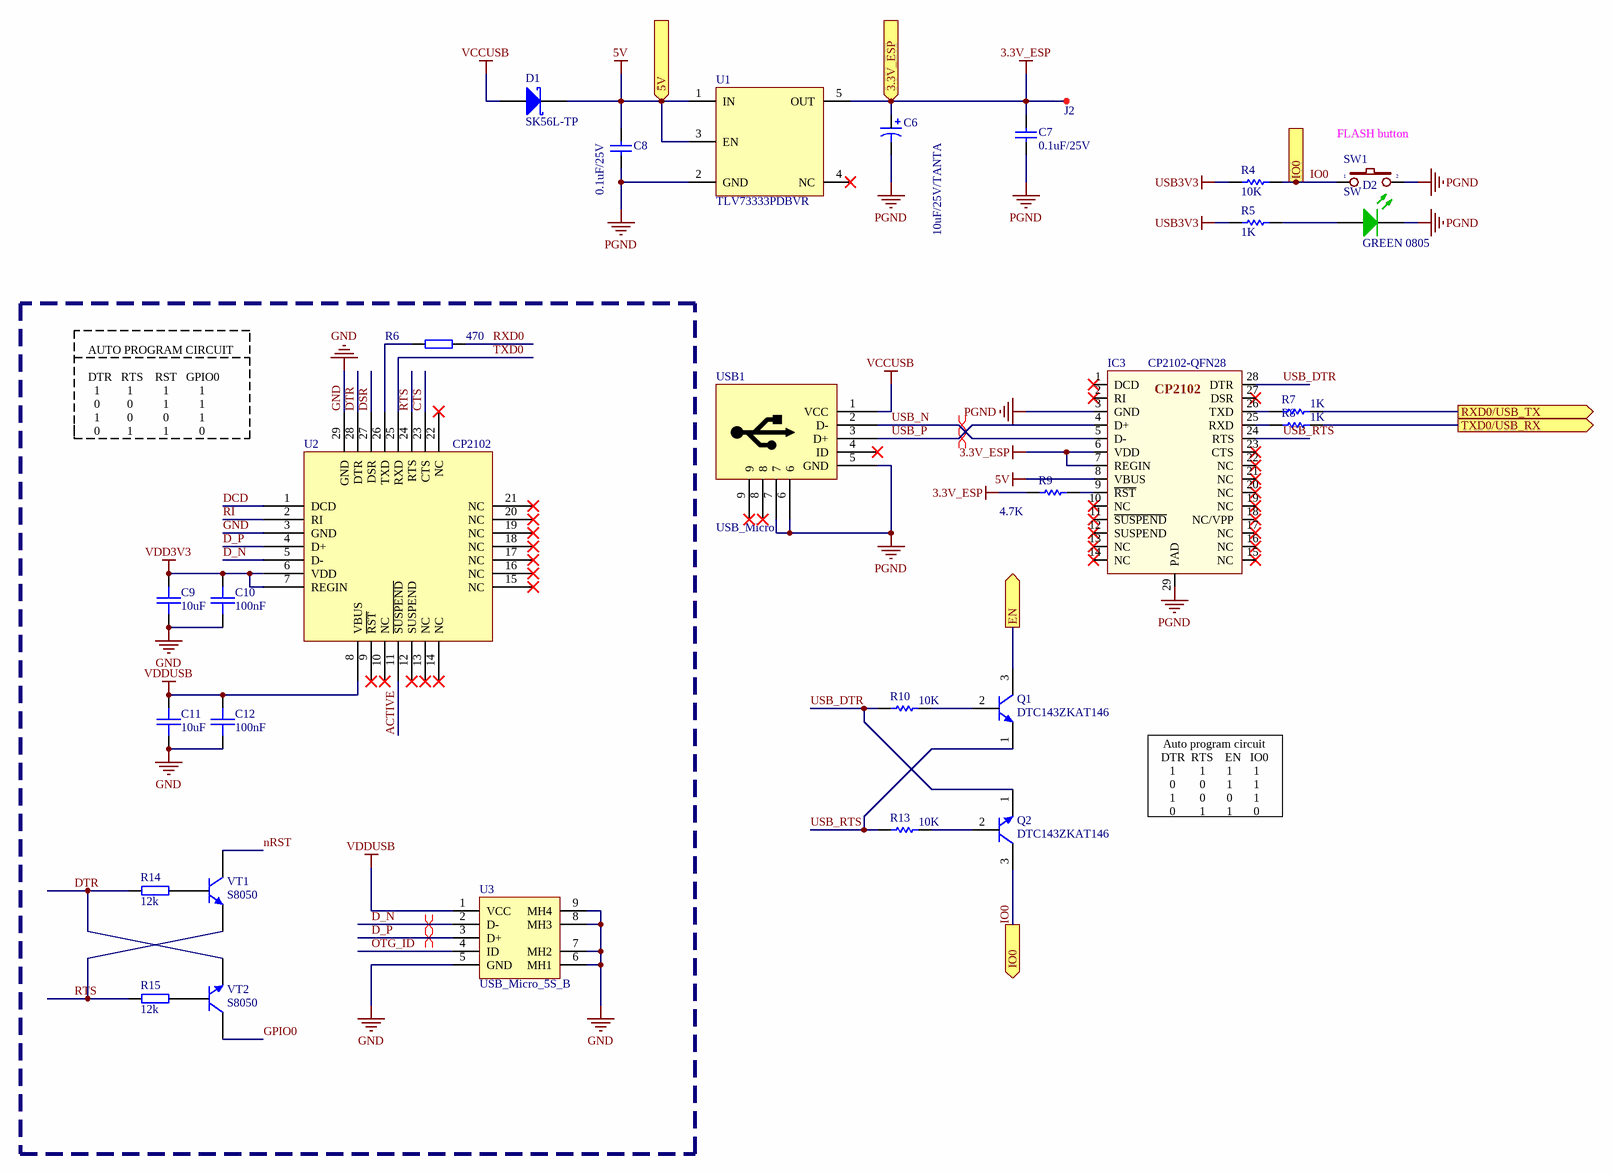
[diagram p4: Sheet3.SchDoc]

### Parts
(Parts that share a designator on the sheet are numbered #1, #2 ... from top to bottom, then left to right.)
C6#2  10uF/25V/TANTA  [CAP TANT CASE B SMD]
C7#2  0.1uF/25V  [CAP_CERA_C2012(CC0805INCH)]
C8#2  0.1uF/25V  [CAP_CERA_C2012(CC0805INCH)]
C9#2  10uF  [SMT_C_0402]
C10#2  100nF  [SMT_C_0402]
C11  10uF  [SMT_C_0402]
C12  100nF  [SMT_C_0402]
D1  SK56L-TP  [30# SK56L-TPMSCT-ND]
D2  GREEN 0805  [Led 0805G]
IC3  CP2102-QFN28  [CP2102]
J2  TEST POINT  [TEST POINT 1mm]  (value not drawn)
Q1  DTC143ZKAT146  [6# DTC143ZKAT146-E]
Q2  DTC143ZKAT146  [6# DTC143ZKAT146-E]
R4  10K  [Res 0805 SMD]
R5  1K  [Res 0805 SMD]
R6  470  [SMT_R_0402]
R7  1K  [Res 0805 SMD]
R8  1K  [Res 0805 SMD]
R9  4.7K  [Res 0805 SMD]
R10  10K  [Res 0805 SMD]
R13  10K  [Res 0805 SMD]
R14  12k  [SMT_R_0402]
R15  12k  [SMT_R_0402]
SW1  SW  [BUTTON 2PIN TRON]
U1#2  TLV73333PDBVR  [20# TLV73333PDBVR]
U2  CP2102  [CP2102]
U3  USB_Micro_5S_B  [USB_MICRO_5S_B]
USB1  USB_Micro  [USBMNIB]
VT1  S8050  [SMT_TRIODE_NPN]
VT2  S8050  [SMT_TRIODE_NPN]

### Ports
3.3V_ESP (in), 5V (in), EN (out), IO0 (out), RXD0/USB_TX (out), TXD0/USB_RX (out)

### Nets
3.3V_ESP: C6#2.1 C7#2.2 IC3.6(VDD) IC3.7(REGIN) J2.1(TP) R9.1 U1#2.5(OUT) ; port 3.3V_ESP
5V: C8#2.2 D1.2(K) IC3.8(VBUS) U1#2.1(IN) U1#2.3(EN) ; port 5V
GND: C9#2.2 C10#2.2 C11.2 C12.2 U2.3(GND) U2.29(GND) U3.5(GND) U3.6(MH1) U3.7(MH2) U3.8(MH3) U3.9(MH4)
PGND: C6#2.2 C7#2.1 C8#2.1 D2.2(K) IC3.3(GND) IC3.29(PAD) SW1.2 U1#2.2(GND) USB1.5(GND) USB1.6 USB1.7
USB3V3: R4.1 R5.1
VCCUSB: D1.1(A) USB1.1(VCC)
VDD3V3: C9#2.1 C10#2.1 U2.6(VDD) U2.7(REGIN)
VDDUSB: C11.1 C12.1 U2.8(VBUS) U3.1(VCC)
ACTIVE: U2.11(~{SUSPEND})
CTS: U2.23(CTS)
D_N: U2.5(D-) U3.2(D-)
D_P: U2.4(D+) U3.3(D+)
DCD: U2.1(DCD)
DSR: U2.27(DSR)
DTR: R14.2 U2.28(DTR) VT2.2(E)
GPIO0: VT2.3(C)
IO0: Q2.3(C) R4.2 SW1.1 ; port IO0
nRST: VT1.3(C)
OTG_ID: U3.4(ID)
RI: U2.2(RI)
RTS: R15.2 U2.24(RTS) VT1.2(E)
RXD0: R6.2
TXD0: U2.25(RXD)
USB_DTR: IC3.28(DTR) Q2.1(E) R10.2
USB_N: IC3.5(D-) USB1.2(D-)
USB_P: IC3.4(D+) USB1.3(D+)
USB_RTS: IC3.24(RTS) Q1.1(E) R13.2
NetD2_1: D2.1(A) R5.2
NetIC3_9: IC3.9(~{RST}) R9.2
NetIC3_25: IC3.25(RXD) R8.2
NetIC3_26: IC3.26(TXD) R7.2
NetQ1_2: Q1.2(B) R10.1
NetQ1_3: Q1.3(C) ; port EN
NetQ2_2: Q2.2(B) R13.1
NetR6_1: R6.1 U2.26(TXD)
NetR7_1: R7.1 ; port RXD0/USB_TX
NetR8_1: R8.1 ; port TXD0/USB_RX
NetR14_1: R14.1 VT1.1(B)
NetR15_1: R15.1 VT2.1(B)

Not connected (* = marked no-connect by the designer): IC3 1(DCD)* 2(RI)* 10(NC)* 11(~{SUSPEND})* 12(SUSPEND)* 13(NC)* 14(NC)* 15(NC)* 16(NC)* 17(NC)* 18(NC/VPP)* 19(NC)* 20(NC)* 21(NC)* 22(NC)* 23(CTS)* 27(DSR)*; U1#2 4(NC)*; U2 9(~{RST})* 10(NC)* 12(SUSPEND)* 13(NC)* 14(NC)* 15(NC)* 16(NC)* 17(NC)* 18(NC)* 19(NC)* 20(NC)* 21(NC)* 22(NC)*; USB1 4(ID)* 8* 9*

### Layout directives
differential pair: D_N, D_P, USB_N, USB_P

### Notes on the sheet
- (near SW1) FLASH button
- AUTO PROGRAM CIRCUIT
  DTR   RTS    RST   GPIO0
  1         1          1          1
  0         0          1          1
  1         0          0          1
  0         1          1          0
- Auto program circuit
  DTR  RTS    EN   IO0
  1        1       1       1
  0        0       1       1
  1        0       0       1
  0        1       1       0
- Van Hieu
- Date:
- Size:
- A3
- Number:
- Time:
- Sheet
- Revision:
- of
- BK-DN
- File:
- maivanhieu24042003@gmail.com

### Library data of the parts
C6#2 = TAJB106M025RNJ: 10µF Molded Tantalum Capacitors 25V 1411 (3528 Metric) 3 Ohm; Manufacturer: KEMET; Digikey: 399-5125-1-ND
C7#2 = 0.1uF/50V/C0603/10%: 0.1µF ±10% 25V Ceramic Capacitor X7R 0805 (2012 Metric); Manufacturer: KEMET; ComponentLink1URL: http://www.murata.com/~/media/webrenewal/support/library/catalog/products/capacitor/mlcc/c02e.ashx; ComponentLink1Description: http://www.murata.com/~/media/webrenewal/support/library/catalog/products/capacitor/mlcc/c02e.ashx; Digikey: 478-3755-1-ND
C8#2 = 0.1uF/50V/C0603/10%: as C6#1 on sheet Communication; ComponentLink1URL: http://www.murata.com/~/media/webrenewal/support/library/catalog/products/capacitor/mlcc/c02e.ashx; ComponentLink1Description: http://www.murata.com/~/media/webrenewal/support/library/catalog/products/capacitor/mlcc/c02e.ashx; Digikey: 478-3755-1-ND
C9#2 C10#2 C11 C12 = SMT_C_0402: Surface mount capacitor 0402
D1 = 30# SK56L-TP: DIODE SCHOTTKY 60V 5A DO214AB; ComponentLink1URL: http://www.mccsemi.com/up_pdf/SK52L-SK510L(DO-214AB).PDF; ComponentLink1Description: http://www.mccsemi.com/up_pdf/SK52L-SK510L(DO-214AB).PDF; Digikey: SK56L-TPMSCT-ND
D2 = LED GREEN 0603: as D3 on sheet ESP32; ComponentLink1URL: http://optoelectronics.liteon.com/upload/download/DS22-2000-074/S_110_LTST-C190KGKT.pdf; ComponentLink1Description: http://optoelectronics.liteon.com/upload/download/DS22-2000-074/S_110_LTST-C190KGKT.pdf; Digikey: 160-1426-1-ND
IC3 = CP2102
J2 = PAD 1mm: TPoint
Q1 Q2 = 6#DTC143ZKAT146: as Q3 on sheet ESP32; Digikey: DTC143ZKAT146CT-ND
R4 = 200K/R0603/1%: as R20 on sheet ESP32; RoHS: RoHS Compliant; Category: Resistors; Part Status: Active; Features: Moisture Resistant; Operating Temperature: -55°C ~ 155°C; Package / Case: 0603 (1608 Metric); Supplier Device Package: 0603; Size / Dimension: 0.063" L x 0.031" W (1.60mm x 0.80mm); Height - Seated (Max): 0.022" (0.55mm); Failure Rate: -; ComponentLink1URL: http://www.yageo.com/documents/recent/PYu-RC_Group_51_RoHS_L_7.pdf; ComponentLink1Description: http://www.yageo.com/documents/recent/PYu-RC_Group_51_RoHS_L_7.pdf; Digikey: A126332CT-ND
R5 = 200K/R0603/1%: as R22 on sheet ESP32; RoHS: RoHS Compliant; Category: Resistors; Part Status: Active; Features: Moisture Resistant; Operating Temperature: -55°C ~ 155°C; Package / Case: 0603 (1608 Metric); Supplier Device Package: 0603; Size / Dimension: 0.063" L x 0.031" W (1.60mm x 0.80mm); Height - Seated (Max): 0.022" (0.55mm); Failure Rate: -; ComponentLink1URL: http://www.yageo.com/documents/recent/PYu-RC_Group_51_RoHS_L_7.pdf; ComponentLink1Description: http://www.yageo.com/documents/recent/PYu-RC_Group_51_RoHS_L_7.pdf; Digikey: 541-1.00KCCT-ND
R6 R14 R15 = SMT_R_0402: Surface mount resistor 0402
R7 R8 = 34.8K/R0805/1%: as R24 on sheet ESP32; Case/Package: 0603; Case Code (Imperial): 0603; Case Code (Metric): 1608; Min Operating Temperature: -55°C; Max Operating Temperature: 155°C; Termination: SMD/SMT; Military Standard: Not; Voltage Rating (DC): 50V; Length: 1.6mm; Height: 0.45mm; Width: 0.8mm; Depth: 0.8mm; Lead Free: Lead Free; Digikey: 541-1.00KCCT-ND
R9 = 34.8K/R0805/1%: as R26 on sheet ESP32; Digikey: 541-4131-1-ND
R10 R13 = 34.8K/R0805/1%: as R27 on sheet ESP32; Case/Package: 0603; Case Code (Imperial): 0603; Case Code (Metric): 1608; Min Operating Temperature: -55°C; Max Operating Temperature: 155°C; Termination: SMD/SMT; Military Standard: Not; Voltage Rating (DC): 50V; Length: 1.6mm; Height: 0.45mm; Width: 0.8mm; Depth: 0.8mm; Lead Free: Lead Free; Digikey: A126332CT-ND
SW1 = SW2: as SW3 on sheet ESP32
U1#2 = 20#TLV73333PDBVR: Linear Voltage Regulator IC Positive Fixed 1 Output 3.3V 300mA SOT-23-5; Digikey: 296-40673-1-ND
U3 = USB_Micro_5S_B: USB micro female SMT with 4 fixed foot
USB1 = USB_MINI
VT1 VT2 = SMT_TRIODE_NPN: Surface mount NPN transistor, package SOT-23

## Sheet Relay.SchDoc
size A4; Author: Van Hieu; Organization: BACH-KHOA-DK; SheetNumber: 5; SheetTotal: 6; Gmail: maivanhieu24042003@gmail.com
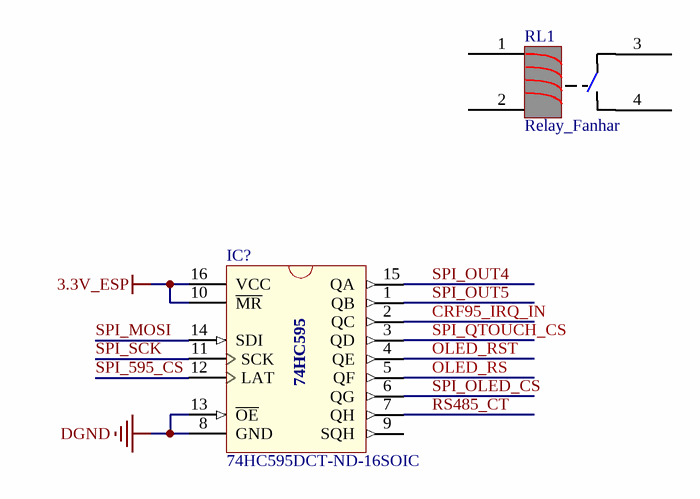
[diagram p5: Relay.SchDoc]

### Parts
IC?  74HC595DCT-ND-16SOIC  [DIP16/W0.3]
RL1  Relay_Fanhar  [Relay_Fanhar]

### Nets
3.3V_ESP: IC?.10(~{MR}) IC?.16(VCC)
DGND: IC?.8(GND) IC?.13(~{OE})
CRF95_IRQ_IN: IC?.2(QC)
OLED_RS: IC?.5(QF)
OLED_RST: IC?.4(QE)
RS485_CT: IC?.7(QH)
SPI_595_CS: IC?.12(LAT)
SPI_MOSI: IC?.14(SDI)
SPI_OLED_CS: IC?.6(QG)
SPI_OUT4: IC?.15(QA)
SPI_OUT5: IC?.1(QB)
SPI_QTOUCH_CS: IC?.3(QD)
SPI_SCK: IC?.11(SCK)

Not connected (* = marked no-connect by the designer): IC? 9(SQH); RL1 1(c) 2(c) 3(NO) 4(COM)

### Notes on the sheet
- Van Hieu
- Date:
- Size:
- A4
- Number:
- Time:
- Sheet
- Revision:
- of
- BK-DN
- File:
- maivanhieu24042003@gmail.com

### Library data of the parts
IC? = 74HC595: 8 Bit Serial input - Parallel Output; Value: 74HC595
RL1 = Relay_Fanhar: Fanhar-W11-1A2STLE-H / DC5V / Relay

## Nets that join several sheets
3.3V_ESP: ESP32 (5 pins), Sheet3 (7 pins), Relay (IC?.10 IC?.16)
5V: ESP32 (D4.2 IC4.8 P7.13), Sheet3 (5 pins)
DGND: ESP32 (11 pins), Relay (IC?.8 IC?.13)
GND: Communication (7 pins), ESP32 (7 pins), Sheet3 (11 pins)
PGND: ESP32 (P7.15), STM32F103VET6 (SW2.2), Sheet3 (11 pins)